# Altium schematic sheet design_17.SchDoc: design
size 414 x 279 mm; Date: 1/25/2021 11:39:22 PM; SheetNumber: 18; Origin: Eagle; GateName_1: G$1; SymbolName_1: A3-L-GUMSTIX; LibraryName: qualified_1; DeviceSetName: A3-L-GUMSTIX; A: A; B: B; C: C; D: D; E: E; F: F; G: G; H: H; 1: 1; 2: 2; 3: 3; 4: 4; 5: 5; Sheet: Sheet:; C:/Gumstix/gumstix-logo-16.bmp: C:/Gumstix/gumstix-logo-16.bmp; Board: Board:
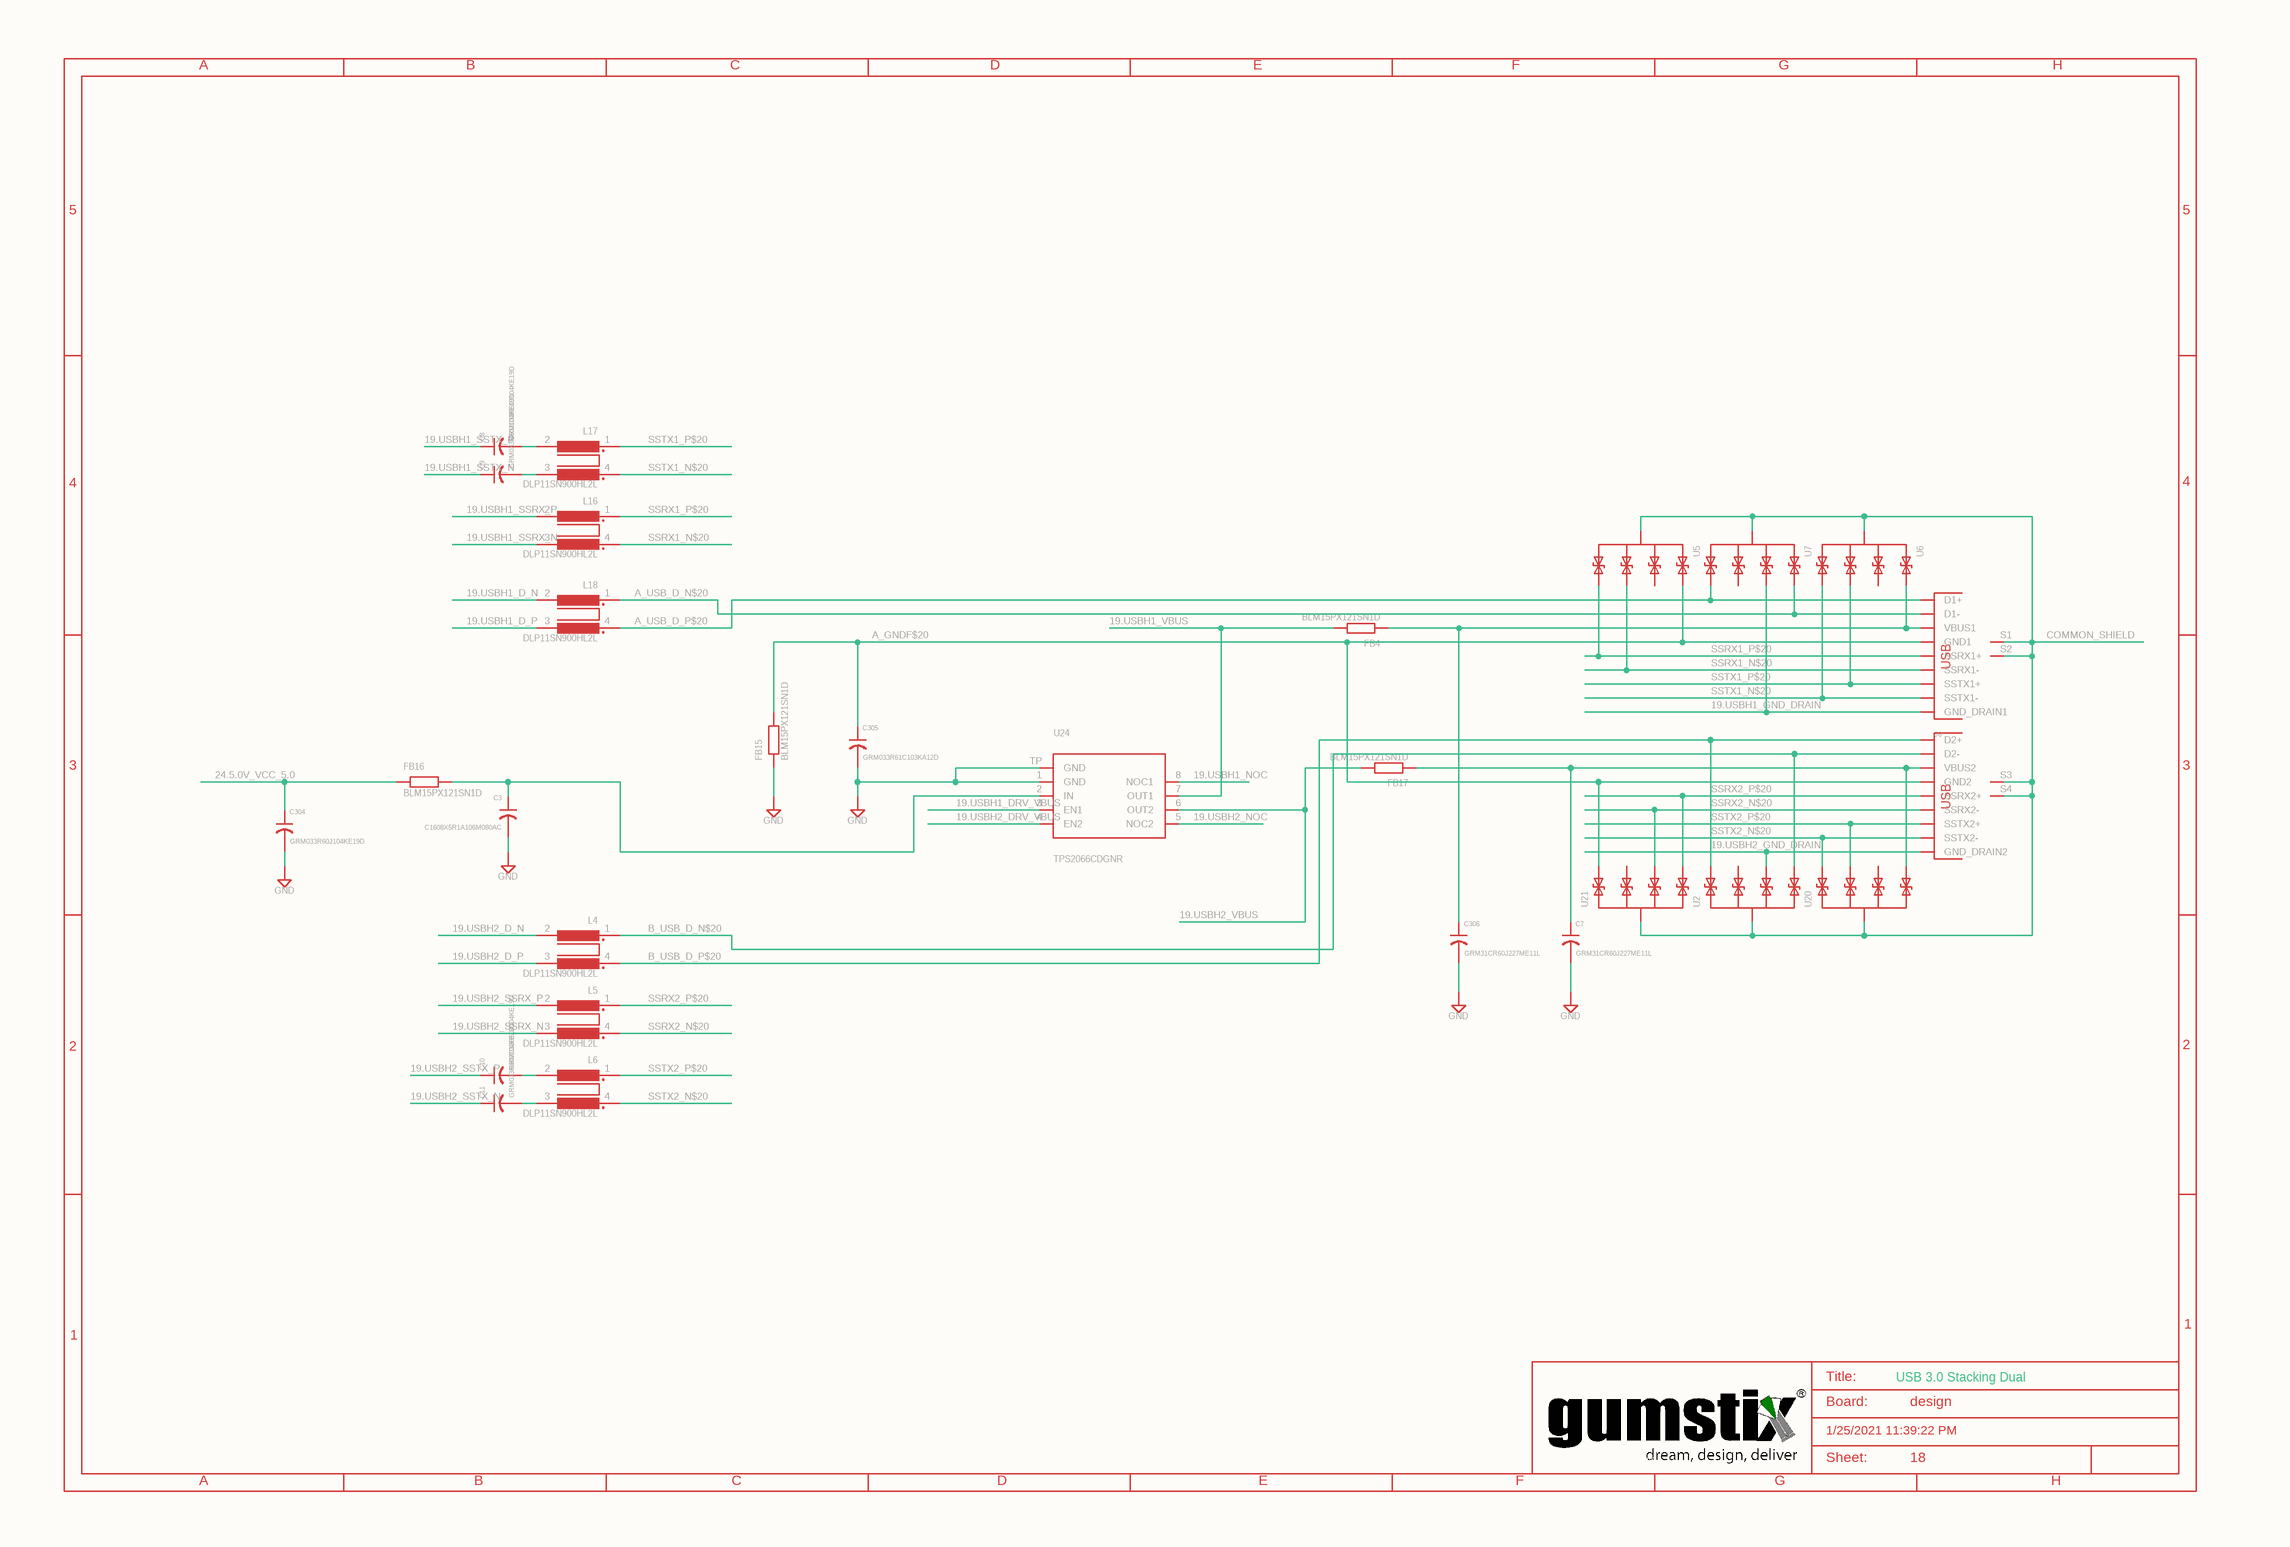
[diagram p0: design_17.SchDoc]

## Parts
C3  C1608X5R1A106M080AC  [0603]
C7  GRM31CR60J227ME11L  [1206]
C8  GRM033R60J104KE19D  [0201]
C9  GRM033R60J104KE19D  [0201]
C10  GRM033R60J104KE19D  [0201]
C11  GRM033R60J104KE19D  [0201]
C304  GRM033R60J104KE19D  [0201]
C305  GRM033R61C103KA12D  [0201]
C306  GRM31CR60J227ME11L  [1206]
FB4  BLM15PX121SN1D  [0402]
FB15  BLM15PX121SN1D  [0402]
FB16  BLM15PX121SN1D  [0402]
FB17  BLM15PX121SN1D  [0402]
J6  GSB311231HR  [USB3-A-H-DUAL]  (value not drawn)
L4  DLP11SN900HL2L  [0504-DLP11S]
L5  DLP11SN900HL2L  [0504-DLP11S]
L6  DLP11SN900HL2L  [0504-DLP11S]
L16  DLP11SN900HL2L  [0504-DLP11S]
L17  DLP11SN900HL2L  [0504-DLP11S]
L18  DLP11SN900HL2L  [0504-DLP11S]
SUPPLY10  GND
SUPPLY12  GND
SUPPLY172  GND
SUPPLY173  GND
SUPPLY179  GND
SUPPLY193  GND
U2  TPD4E02B04DQAR  [UFDFN-10]  (value not drawn)
U5  TPD4E02B04DQAR  [UFDFN-10]  (value not drawn)
U6  TPD4E02B04DQAR  [UFDFN-10]  (value not drawn)
U7  TPD4E02B04DQAR  [UFDFN-10]  (value not drawn)
U20  TPD4E02B04DQAR  [UFDFN-10]  (value not drawn)
U21  TPD4E02B04DQAR  [UFDFN-10]  (value not drawn)
U24  TPS2066CDGNR  [MSOP8-PAD]

## Nets
19.USBH1_D_N: L18.2
19.USBH1_D_P: L18.3
19.USBH1_DRV_VBUS: U24.3(EN1)
19.USBH1_GND_DRAIN: J6.7(GND_DRAIN1) U7.2_9(P2)
19.USBH1_NOC: U24.8(NOC1)
19.USBH1_SSRX_N: L16.3
19.USBH1_SSRX_P: L16.2
19.USBH1_SSTX_N: C9.1
19.USBH1_SSTX_P: C8.1
19.USBH1_VBUS: FB4.2 U24.7(OUT1)
19.USBH2_D_N: L4.2
19.USBH2_D_P: L4.3
19.USBH2_DRV_VBUS: U24.4(EN2)
19.USBH2_GND_DRAIN: J6.12(D2+) J6.14(SSRX2-) J6.15(SSRX2+) J6.16(GND_DRAIN2) J6.17(SSTX2-) J6.18(SSTX2+) L4.4 L5.1 L5.4 L6.1 L6.4 U2.1_10(P1) U2.4_7(P3) U20.1_10(P1) U20.2_9(P2) U21.4_7(P3) U21.5_6(P4)  [also labelled B_USB_D_P$20, SSRX2_N$20, SSRX2_P$20, SSTX2_N$20, SSTX2_P$20]
19.USBH2_NOC: U24.5(NOC2)
19.USBH2_SSRX_N: L5.3
19.USBH2_SSRX_P: L5.2
19.USBH2_SSTX_N: C11.1
19.USBH2_SSTX_P: C10.1
19.USBH2_VBUS: FB17.2 U24.6(OUT2)
24.5.0V_VCC_5.0: C304.1 FB16.1
A_GNDF$20: C305.1 FB15.2 J6.4(GND1) J6.13(GND2) U5.1_10(P1) U21.1_10(P1)
A_USB_D_N$20: J6.2(D1-) L18.1 U7.1_10(P1)
A_USB_D_P$20: J6.3(D1+) L18.4 U7.5_6(P4)
B_USB_D_N$20: J6.11(D2-) L4.1 U2.5_6(P4)
COMMON_SHIELD: J6.S1(SH1) J6.S2(SH2) J6.S3(SH3) J6.S4(SH4) U2.3_8(SHIELD) U5.3_8(SHIELD) U6.3_8(SHIELD) U7.3_8(SHIELD) U20.3_8(SHIELD) U21.3_8(SHIELD)
SSRX1_N$20: J6.5(SSRX1-) L16.4 U5.4_7(P3)
SSRX1_P$20: J6.6(SSRX1+) L16.1 U5.5_6(P4)
SSTX1_N$20: J6.8(SSTX1-) L17.4 U6.5_6(P4)
SSTX1_P$20: J6.9(SSTX1+) L17.1 U6.4_7(P3)
NetC3_1: C3.1 FB16.2 U24.2(IN)
NetC3_2: C3.2 SUPPLY179.?1(GND)
NetC7_1: C7.1 FB17.1 J6.10(VBUS2) U20.5_6(P4)
NetC7_2: C7.2 SUPPLY193.?1(GND)
NetC8_2: C8.2 L17.2
NetC9_2: C9.2 L17.3
NetC10_2: C10.2 L6.2
NetC11_2: C11.2 L6.3
NetC304_2: C304.2 SUPPLY12.?1(GND)
NetC305_2: C305.2 SUPPLY10.?1(GND) U24.1(GND) U24.TP(GND)
NetC306_1: C306.1 FB4.1 J6.1(VBUS1) U6.1_10(P1)
NetC306_2: C306.2 SUPPLY173.?1(GND)
NetFB15_1: FB15.1 SUPPLY172.?1(GND)

Not connected (* = marked no-connect by the designer): U2 2 9(P2); U5 2 9(P2); U6 2 9(P2); U7 4 7(P3); U20 4 7(P3); U21 2 9(P2)

## Notes on the sheet
- A
- B
- C
- D
- E
- F
- G
- H
- 5
- 4
- 3
- 2
- 1
- Title:
- Board:
- USB 3.0 Stacking Dual
- design
- C:/Gumstix/gumstix-logo-16.bmp
- 1/25/2021 11:39:22 PM
- Sheet:
- 18

## Library data of the parts
C3 = C1608X5R1A106M080AC: GateName_1: G$1; SymbolName_1: C-US; LibraryName: qualified_1@eagle_src_repo_d00aa7e5b0aed880e2479218df7f64b10b504166; DeviceSetName: C1608X5R1A106M080AC; DM: DM; DR: DR; DX: DX; DY: DY; HEIGHT: 0.5; SHEETNO: SHEETNO
C7 C306 = GRM31CR60J227ME11L: GateName_1: G$1; SymbolName_1: C-US; LibraryName: qualified_1@eagle_src_repo_d00aa7e5b0aed880e2479218df7f64b10b504166; DeviceSetName: GRM31CR60J227ME11L; HEIGHT: 0.51
C8-C11 C304 = GRM033R60J104KE19D: GateName_1: G$1; SymbolName_1: C-US; LibraryName: qualified_1@eagle_src_repo_d00aa7e5b0aed880e2479218df7f64b10b504166; DeviceSetName: GRM033R60J104KE19D; HEIGHT: 0.25
  C304: DM: DM; DR: DR; DX: DX; DY: DY; SHEETNO: SHEETNO
C305 = GRM033R61C103KA12D: GateName_1: G$1; SymbolName_1: C-US; LibraryName: qualified_1@eagle_src_repo_d00aa7e5b0aed880e2479218df7f64b10b504166; DeviceSetName: GRM033R61C103KA12D; DM: DM; DR: DR; DX: DX; DY: DY; HEIGHT: 0.25; SHEETNO: SHEETNO
FB4 FB15-FB17 = BLM15PX121SN1D: GateName_1: G$1; SymbolName_1: FB; LibraryName: qualified_1@eagle_src_repo_d00aa7e5b0aed880e2479218df7f64b10b504166; DeviceSetName: BLM15PX121SN1D; DM: DM; DR: DR; DX: DX; DY: DY; HEIGHT: 0.35; SHEETNO: SHEETNO
J6 = GSB311231HR: USB 3.0 Stacking Dual Host Port    http://media.digikey.com/pdf/Data%20Sheets/Amphenol%20PDFs/GSB31123xxHR_Dwg.PDF; GateName_1: J1; SymbolName_1: USB3-H-DUAL; LibraryName: qualified_1; DeviceSetName: GSB311231HR; USB: USB
L4-L6 L16-L18 = DLP11SN900HL2L: GateName_1: G$1; SymbolName_1: COM_MODE_CHOKE_DLP; LibraryName: qualified_1@eagle_src_repo_d00aa7e5b0aed880e2479218df7f64b10b504166; DeviceSetName: DLP11SN900HL2L; HEIGHT: 0.83
SUPPLY10 SUPPLY12 SUPPLY172 SUPPLY173 SUPPLY179 SUPPLY193 = GND: SUPPLY SYMBOL; SymbolName_1: GND-2; GateName_1: GND; LibraryName: qualified_1; DeviceSetName: GND
U2 U5-U7 U20 U21 = TPD4E02B04DQAR: TPD4E02B04 4-Channel ESD Protection Diode for USB Type-C and HDMI 2.0    http://www.ti.com/lit/ds/symlink/tpd4e02b04.pdf; GateName_1: G1; SymbolName_1: ESD-DIODE-4; LibraryName: qualified_1; DeviceSetName: TPD4E02B04DQAR
U24 = TPS2066CDGNR: GateName_1: G$1; SymbolName_1: TPS2052; LibraryName: qualified_1; DeviceSetName: TPS2066CDGNR; HEIGHT: 1.1